# EAGLE design ExternalMotorControllerRev2 (EAGLE 6.4)

## Sheet 1 of 7
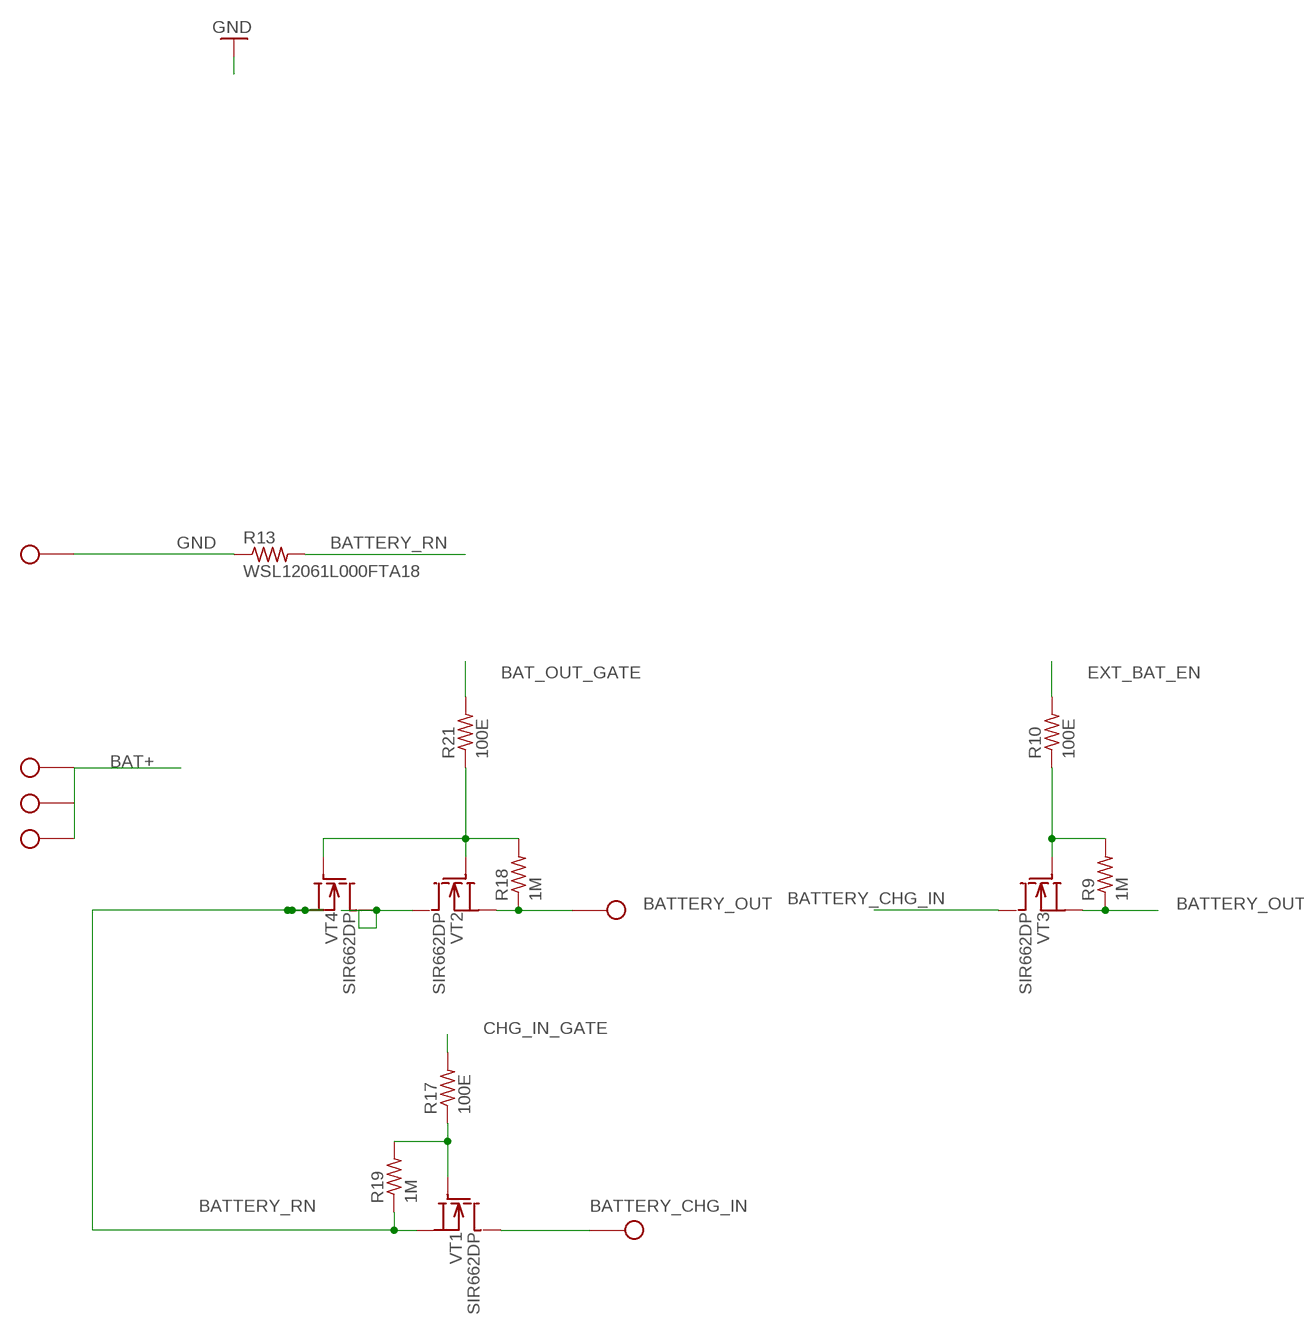
[diagram p0: schematic, sheet 1]

### Parts
R9  1M  R-US_R0402  [R0402]
R10  100E  R-US_R0402  [R0402]
R13  WSL12061L000FTA18  R-US_R2512  [R2512]
R17  100E  R-US_R0402  [R0402]
R18  1M  R-US_R0402  [R0402]
R19  1M  R-US_R0402  [R0402]
R21  100E  R-US_R0402  [R0402]
VT1  SIR662DP  [POWERPAK_SO8]
VT2  SIR662DP  [POWERPAK_SO8]
VT3  SIR662DP  [POWERPAK_SO8]
VT4  SIR662DP  [POWERPAK_SO8]
X1  SOLDER_HOLE18AWG  [SOLDER_HOLE_18]
X2  SOLDER_HOLE18AWG  [SOLDER_HOLE_18]
X3  SOLDER_HOLE18AWG  [SOLDER_HOLE_18]
X4  SOLDER_HOLE18AWG  [SOLDER_HOLE_18]
X5  SOLDER_HOLE18AWG  [SOLDER_HOLE_18]
X13  SOLDER_HOLE18AWG  [SOLDER_HOLE_18]

### Nets
BAT+: X1.1 X4.1 X5.1 ; also sheet 3,4
BAT_OUT_GATE: R21.2 ; also sheet 7
BATTERY_CHG_IN: VT1.D VT3.D X2.1
BATTERY_OUT: R9.1 R18.1 VT2.S1(S) VT2.S2(S) VT2.S3(S) VT3.S1(S) VT3.S2(S) VT3.S3(S) X3.1 ; also sheet 7
BATTERY_RN: R13.2 R19.1 VT1.S1(S) VT1.S2(S) VT1.S3(S) VT4.S1(S) VT4.S2(S) VT4.S3(S) ; also sheet 7
CHG_IN_GATE: R17.2 ; also sheet 7
EXT_BAT_EN: R10.2 ; also sheet 7
GND: R13.1 X13.1 ; also sheet 3,4,7
N$1: R9.2 R10.1 VT3.G
N$5: VT2.D VT4.D
N$24: R18.2 R21.1 VT2.G VT4.G
N$25: R17.1 R19.2 VT1.G

## Sheet 2 of 7

## Sheet 3 of 7
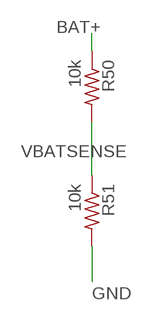
[diagram p1: schematic, sheet 3]

### Parts
R50  10k  R-US_R0402  [R0402]
R51  10k  R-US_R0402  [R0402]

### Nets
BAT+: R50.1 ; also sheet 1,4
GND: R51.2 ; also sheet 1,4,7
VBATSENSE: R50.2 R51.1 ; also sheet 7

## Sheet 4 of 7
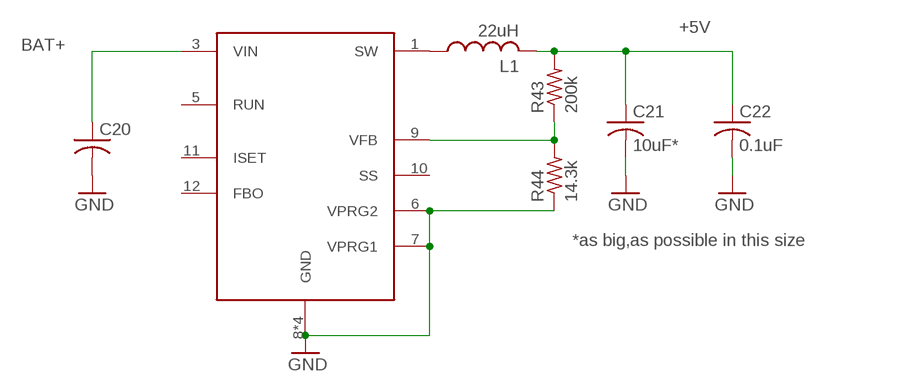
[diagram p2: schematic, sheet 4]

### Parts
C20  RCL_C-USC0805  [RCL_C0805$1]
C21  10uF*  RCL_C-USC4532  [RCL_C4532$1]
C22  0.1uF  C-USC0402  [C0402]
DA2  LTC3630  [MSE16(12)]
L1  22uH  M-PAD-2.1_L_USD  [M-PAD-2.1_1210]
R43  200k  RCL_R-US_R0402  [RCL_R0402]
R44  14.3k  RCL_R-US_R0402  [RCL_R0402]

### Nets
+5V: C21.1 C22.1 L1.2 R43.2 ; also sheet 7
BAT+: C20.1 DA2.3(VIN) ; also sheet 1,3
GND: C20.2 C21.2 C22.2 DA2.6(VPRG2) DA2.7(VPRG1) DA2.8(GND) DA2.14(GND) DA2.16(GND) DA2.17(GND) R44.1 ; also sheet 1,3,7
N$51: DA2.1(SW) L1.1
N$52: DA2.9(VFB) R43.1 R44.2
Unconnected: DA2.5(RUN) DA2.10(SS) DA2.11(ISET) DA2.12(FBO)

### Notes on the sheet
- *as big,as possible in this size

## Sheet 5 of 7

## Sheet 6 of 7

## Sheet 7 of 7
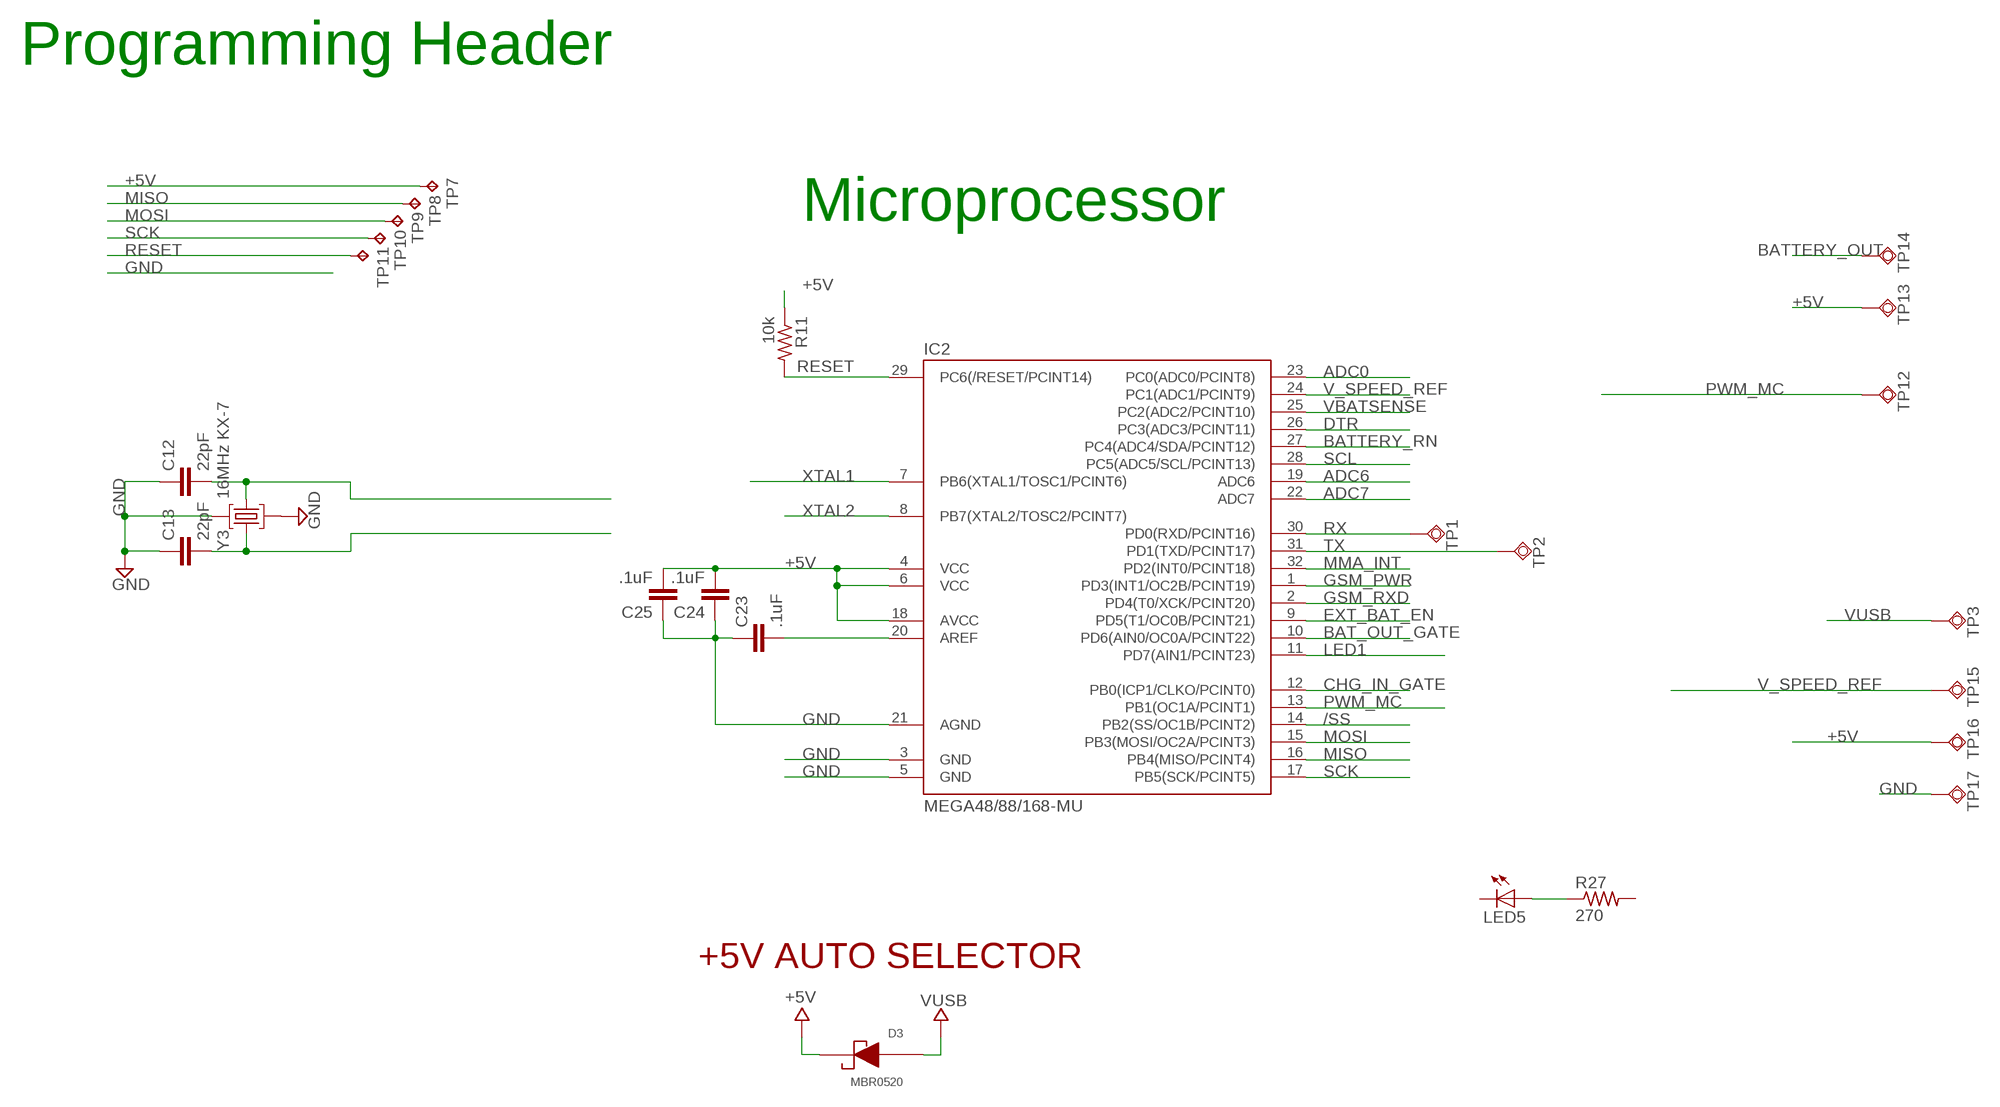
[diagram p3: schematic, sheet 7]

### Parts
C12  22pF  C-EUC0402  [C0402]
C13  22pF  C-EUC0402  [C0402]
C23  .1uF  C-EUC0402  [C0402]
C24  .1uF  C-EUC0402  [C0402]
C25  .1uF  C-EUC0402  [C0402]
D3  MBR0520  [SOD-123]
IC2  MEGA48/88/168-MU  [MLF32]
LED5  LEDCHIP-LED0603  [CHIP-LED0603]
R11  10k  R-US_R0402  [R0402]
R27  270  R-US_R0402  [R0402]
TP1  TPSQTP15R  [TP15R]
TP2  TPSQTP15R  [TP15R]
TP3  TPSQTP15R  [TP15R]
TP7  TPTP08R  [TP08R]
TP8  TPTP08R  [TP08R]
TP9  TPTP08R  [TP08R]
TP10  TPTP08R  [TP08R]
TP11  TPTP10R  [TP10R]
TP12  TPSQTP15SQ  [TP15SQ]
TP13  TPSQTP15SQ  [TP15SQ]
TP14  TPSQTP15SQ  [TP15SQ]
TP15  TPSQTP15R  [TP15R]
TP16  TPSQTP15SQ  [TP15SQ]
TP17  TPSQTP15SQ  [TP15SQ]
Y3  16MHz KX-7  CRYSTAL-3.2-2.5  [CRYSTAL-3.2-2.5]

### Nets
+5V: C24.2 C25.2 D3.1(CA) IC2.4(VCC) IC2.6(VCC) IC2.18(AVCC) R11.1 TP7.TP TP13.TP TP16.TP ; also sheet 4
/SS: IC2.14(PB2(SS/OC1B/PCINT2))
ADC0: IC2.23(PC0(ADC0/PCINT8))
ADC6: IC2.19(ADC6)
ADC7: IC2.22(ADC7)
BAT_OUT_GATE: IC2.10(PD6(AIN0/OC0A/PCINT22)) ; also sheet 1
BATTERY_OUT: TP14.TP ; also sheet 1
BATTERY_RN: IC2.27(PC4(ADC4/SDA/PCINT12)) ; also sheet 1
CHG_IN_GATE: IC2.12(PB0(ICP1/CLKO/PCINT0)) ; also sheet 1
DTR: IC2.26(PC3(ADC3/PCINT11))
EXT_BAT_EN: IC2.9(PD5(T1/OC0B/PCINT21)) ; also sheet 1
GND: C12.1 C13.1 C23.1 C24.1 C25.1 IC2.3(GND) IC2.5(GND) IC2.21(AGND) TP17.TP Y3.2(GND) Y3.4(GND) ; also sheet 1,3,4
GSM_PWR: IC2.1(PD3(INT1/OC2B/PCINT19))
GSM_RXD: IC2.2(PD4(T0/XCK/PCINT20))
LED1: IC2.11(PD7(AIN1/PCINT23))
MISO: IC2.16(PB4(MISO/PCINT4)) TP8.TP
MMA_INT: IC2.32(PD2(INT0/PCINT18))
MOSI: IC2.15(PB3(MOSI/OC2A/PCINT3)) TP9.TP
N$36: C23.2 IC2.20(AREF)
N$50: LED5.A R27.1
PWM_MC: IC2.13(PB1(OC1A/PCINT1)) TP12.TP
RESET: IC2.29(PC6(/RESET/PCINT14)) R11.2 TP11.TP
RX: IC2.30(PD0(RXD/PCINT16)) TP1.TP
SCK: IC2.17(PB5(SCK/PCINT5)) TP10.TP
SCL: IC2.28(PC5(ADC5/SCL/PCINT13))
TX: IC2.31(PD1(TXD/PCINT17)) TP2.TP
V_SPEED_REF: IC2.24(PC1(ADC1/PCINT9)) TP15.TP
VBATSENSE: IC2.25(PC2(ADC2/PCINT10)) ; also sheet 3
VUSB: D3.2(AN) TP3.TP
XTAL1: C13.2 IC2.7(PB6(XTAL1/TOSC1/PCINT6)) Y3.3(C2)
XTAL2: C12.2 IC2.8(PB7(XTAL2/TOSC2/PCINT7)) Y3.1(C1)
Unconnected: LED5.C R27.2

### Notes on the sheet
- Programming Header
- Microprocessor
- +5V AUTO SELECTOR

## Library data of the parts
C12 C13 = SmartPrj:C-EU: CAPACITOR, European symbol
C20 C21 = MotorController_r0:RCL_C-US: CAPACITOR, American symbol
C22 = rcl:C-US: CAPACITOR, American symbol
C23-C25 = rcl:C-EU: CAPACITOR, European symbol
D3 = MySMD:MBR0520
DA2 = my:LTC3630
IC2 = avr-5:MEGA48/88/168
L1 = MotorController_r0:M-PAD-2.1_L_US: Inductors in various packages from: - Sumida - Panasonic - Coilcraft
LED5 = led:LED: LED OSRAM: - CHIPLED LG R971, LG N971, LY N971, LG Q971, LY Q971, LO R971, LY R971 LH N974, LH R974 LS Q976, LO Q976, LY Q976 LO Q996 - Hyper CHIPLED LW Q18S LB Q993, LB Q99A, LB R99A - SideLED LS A670, LO A670, LY A670, LG A670, LP A670 LB A673, LV A673, LT A673, LW A673 LH A674 LY A675 LS A676, LA A676, LO A676, LY A676, LW A676 LS A679, LY A679, LG A679 - Hyper Micro SIDELED® LS Y876, LA Y876, LO Y876, LY Y876 LT Y87S - SmartLED LW L88C, LW L88S LB L89C, LB L89S, LG L890 LS L89K, LO L89K, LY L89K LS L896, LA L896, LO L896, LY L896 - TOPLED LS T670, LO T670, LY T670, LG T670, LP T670 LSG T670, LSP T670, LSY T670, LOP T670, LYG T670 LG T671, LOG T671, LSG T671 LB T673, LV T673, LT T673, LW T673 LH T674 LS T676, LA T676, LO T676, LY T676, LB T676, LH T676, LSB T676, LW T676 LB T67C, LV T67C, LT T67C, LS T67K, LO T67K, LY T67K, LW E67C LS E67B, LA E67B, LO E67B, LY E67B, LB E67C, LV E67C, LT E67C LW T67C LS T679, LY T679, LG T679 LS T770, LO T770, LY T770, LG T770, LP T770 LB T773, LV T773, LT T773, LW T773 LH T774 LS E675, LA E675, LY E675, LS T675 LS T776, LA T776, LO T776, LY T776, LB T776 LHGB T686 LT T68C, LB T68C - Hyper Mini TOPLED® LB M676 - Mini TOPLED Santana® LG M470 LS M47K, LO M47K, LY M47K Source: http://www.osram.convergy.de LUXEON: - LUMILED® LXK2-PW12-R00, LXK2-PW12-S00, LXK2-PW14-U00, LXK2-PW14-V00 LXK2-PM12-R00, LXK2-PM12-S00, LXK2-PM14-U00 LXK2-PE12-Q00, LXK2-PE12-R00, LXK2-PE12-S00, LXK2-PE14-T00, LXK2-PE14-U00 LXK2-PB12-K00, LXK2-PB12-L00, LXK2-PB12-M00, LXK2-PB14-N00, LXK2-PB14-P00, LXK2-PB14-Q00 LXK2-PR12-L00, LXK2-PR12-M00, LXK2-PR14-Q00, LXK2-PR14-R00 LXK2-PD12-Q00, LXK2-PD12-R00, LXK2-PD12-S00 LXK2-PH12-R00, LXK2-PH12-S00 LXK2-PL12-P00, LXK2-PL12-Q00, LXK2-PL12-R00 Source: www.luxeon.com KINGBRIGHT: KA-3528ASYC Source: www.kingbright.com
R9 R10 R13 R17-R19 R21 = ForBattery:R-US_: RESISTOR, American symbol
R11 R27 R50 R51 = rcl:R-US_: RESISTOR, American symbol
R43 R44 = MotorController_r0:RCL_R-US_: RESISTOR, American symbol
TP1-TP3 TP12-TP17 = testpad:TPSQ: Test pad
TP7-TP11 = testpad:TP: Test pad
VT1-VT4 = ForBattery:SIR662DP
X1-X5 X13 = ForBattery:SOLDER_HOLE
Y3 = SmartPrj:CRYSTAL-3.2-2.5

## Board
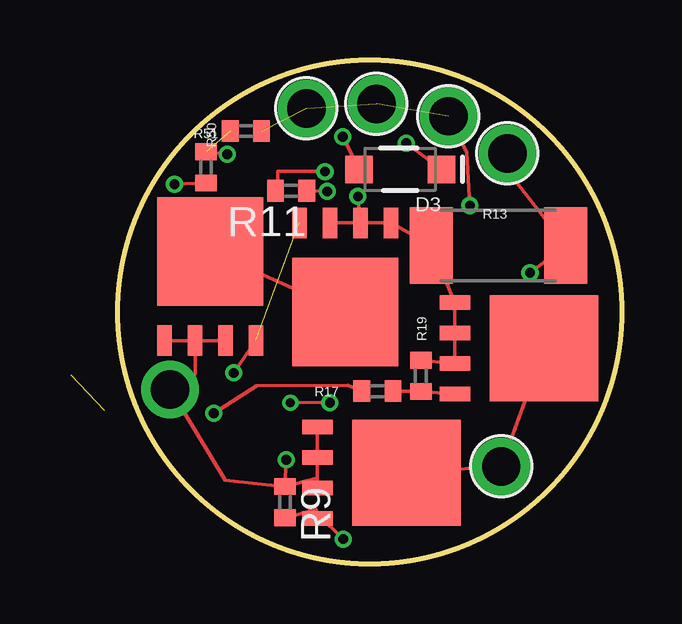
[diagram p4: board, top side]
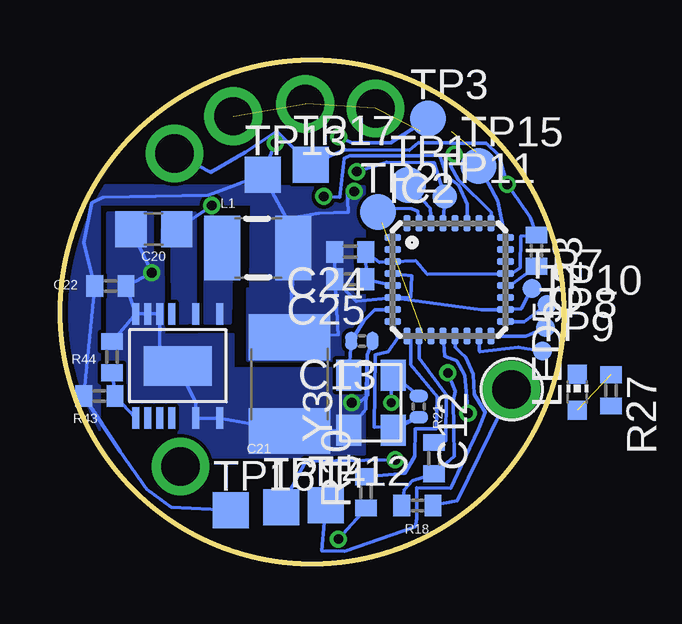
[diagram p5: board, bottom side, seen from below]

Size 21 x 21 mm. Coordinates in mm from the lower left corner, seen from the top.
Outline: circle at 10.5,10.5 radius 10.5
Copper layers (1*16): Top 0.035mm / dielectric 1.5mm / Bottom 0.035mm
Design rules "default *": minimum track width 6mil, minimum drill 16mil, track to track 6mil, track to pad 6mil, pad to pad 6mil, via to via 6mil, smd to smd 6mil, copper to edge 10mil, drill to drill 8mil, minimum pad ring 6mil, minimum via ring 6mil, stop-mask expansion 4mil, vias tented up to drill 0mil, thermal gap 10mil

### Footprints (pad centres in the part's own frame; a part is rotated, then mirrored left to right if it is on the bottom)
C0402 = smd 0.508 x 0.762: 1 -0.445,0; 2 0.445,0
RCL_C0805$1 = smd 1.3 x 1.5: 1 -0.95,0; 2 0.95,0
RCL_C4532$1 = smd 1.9 x 3.4: 1 -1.95,0; 2 1.95,0
C0402' = smd 0.7 x 0.9: 1 -0.65,0; 2 0.65,0
SOD-123 = smd 1.143 x 1.143: 1 0,0; 2 3.429,0
MSE16(12) = smd 0.305 x 0.889: 1 -1.75,-2.171; 3 -0.75,-2.171; 5 0.25,-2.171; 6 0.75,-2.171; 7 1.25,-2.171; 8 1.75,-2.171; 9 1.75,2.171; 10 1.25,2.171; 11 0.75,2.171; 12 0.25,2.171; 14 -0.75,2.171; 16 -1.75,2.171 | smd 2.845 x 1.651: 17 0,0
MLF32 = smd 0.7 x 0.3: 1 -2.35,1.75; 2 -2.35,1.25; 3 -2.35,0.75; 4 -2.35,0.25; 5 -2.35,-0.25; 6 -2.35,-0.75; 7 -2.35,-1.25; 8 -2.35,-1.75; 17 2.35,-1.75; 18 2.35,-1.25; 19 2.35,-0.75; 20 2.35,-0.25; 21 2.35,0.25; 22 2.35,0.75; 23 2.35,1.25; 24 2.35,1.75 | smd 0.3 x 0.7: 9 -1.75,-2.35; 10 -1.25,-2.35; 11 -0.75,-2.35; 12 -0.25,-2.35; 13 0.25,-2.35; 14 0.75,-2.35; 15 1.25,-2.35; 16 1.75,-2.35; 25 1.75,2.35; 26 1.25,2.35; 27 0.75,2.35; 28 0.25,2.35; 29 -0.25,2.35; 30 -0.75,2.35; 31 -1.25,2.35; 32 -1.75,2.35
M-PAD-2.1_1210 = smd 1.5 x 2.7: 1 -1.5,0; 2 1.45,0
CHIP-LED0603 = smd 0.8 x 0.8: A 0,-0.75; C 0,0.75
R0402 = smd 0.7 x 0.9: 1 -0.65,0; 2 0.65,0
R2512 = smd 1.8 x 3.2: 1 -2.8,0; 2 2.8,0
RCL_R0402 = smd 0.7 x 0.9: 1 -0.65,0; 2 0.65,0
TP15R = smd 1.5 x 1.5: TP 0,0
TP08R = smd 0.8 x 0.8: TP 0,0
TP10R = smd 1 x 1: TP 0,0
TP15SQ = smd 1.5 x 1.5: TP 0,0
POWERPAK_SO8 = smd 4.52 x 4.42: D 3.715,0 | smd 1.27 x 0.61: G 0,-1.905; S1 0,1.905; S2 0,0.635; S3 0,-0.635
SOLDER_HOLE_18 = drill 1.6: 1 0,0
CRYSTAL-3.2-2.5 = smd 1.3 x 1.05: 1 -1.15,-0.925; 2 1.15,-0.925; 3 1.15,0.925; 4 -1.15,0.925

### Placement (x,y rotation side)
C12  6.05,6.56 270 bottom
C13  8.42,9.29 180 bottom
C20  17.09,13.96 180 bottom
C21  11.44,7.5 270 bottom
C22  0.1uF  [C0402']  18.9,11.58 0 bottom
C23  .1uF  [C0402']  1.14,13.05 270 bottom
C24  .1uF  [C0402']  8.91,13.01 180 bottom
C25  .1uF  [C0402']  8.9,11.86 180 bottom
D3  13.48,16.44 180 top
DA2  16.09,8.25 180 bottom
IC2  4.79,11.85 0 bottom
L1  12.74,13.17 0 bottom
LED5  -0.55,7.16 0 bottom
R9  6.97,2.58 270 top
R10  8.25,2.98 90 bottom
R11  7.22,15.55 180 top
R13  15.87,13.27 180 top
R17  10.82,7.2 180 top
R18  6.11,2.44 180 bottom
R19  12.63,7.84 270 top
R21  5.41,4.41 90 bottom
R27  -1.95,7.23 270 bottom
R43  19.36,7 180 bottom
R44  18.83,8.62 270 bottom
R50  5.34,18.04 180 top
R51  3.68,16.53 270 top
TP1  6.5,15.79 0 bottom
TP2  7.75,14.66 0 bottom
TP3  5.67,18.56 0 bottom
TP7  1.33,11.48 0 bottom
TP8  0.76,9.85 0 bottom
TP9  0.89,8.87 0 bottom
TP10  0.71,10.8 0 bottom
TP11  4.97,15.31 0 bottom
TP12  9.93,2.44 0 bottom
TP13  12.56,16.22 0 bottom
TP14  11.79,2.37 0 bottom
TP15  3.56,16.59 0 bottom
TP16  13.88,2.24 0 bottom
TP17  10.55,16.63 0 bottom
VT1  14.05,8.99 0 top
VT2  3.86,9.31 90 top
VT3  8.32,3.8 0 top
VT4  9.48,14.22 270 top
X1  7.86,18.98 0 top
X2  15.98,4.06 0 top
X3  2.18,7.27 0 bottom
X4  13.78,18.65 0 top
X5  10.78,19.17 0 top
X13  16.24,17.11 0 top
Y3  8.05,6.72 90 bottom

### Tracks (layer width: path | path; a pad name or v marks a point on that pad's centre or on a via)
+5V  (via drill 0.41)
  Top 0.152: R11.1 v8.74,15.52 | D3.1 v12.02,17.54
  Bottom 0.152: TP7.TP 1.79,10.63 IC2.18 3.46,10.6 IC2.6 | v8.74,15.52 9.03,15.61 8.99,14.66 10.21,14.61 11.56,14.4 | C25.2 C24.2 | C25.2 9.4,9.54 C21.1 | C21.1 L1.2 | C25.2 8.65,10.95 IC2.6 | IC2.4 6.34,12.01 6.39,11.11 IC2.6 | TP16.TP 16.37,2.36 17.38,3.12 18.5,4.68 R43.2 C22.1 20.01,13.39 19.68,15.06 19.19,15.29 14.82,15.37 TP13.TP | C21.1 11.2,13.75 11.56,14.4 | 11.56,14.4 TP13.TP | v12.02,17.54 TP13.TP
  pour Bottom (no thermals): 8.33,8.54 8.33,15.72 21.44,15.78 21.44,4.39 19.37,4.39 19.37,15.01 13,15.01 13.05,11.46 13.17,11.47 13.17,8.49 8.78,8.47
  pour Bottom: 9.76,9.82 13,9.82 13,11.43 9.7,11.43 9.7,10.19
BAT+  (via drill 0.41)  (3 unrouted)
  Top 0.152: v14.68,14.94 14.55,17.16 X4.1
  Bottom 0.152: C20.1 v14.68,14.94
  pour Bottom (no thermals): 15.36,10.07 15.36,14.61 16.7,14.61 16.76,13.36 16.33,13.34 16.31,10.05 15.67,10.05
BAT_OUT_GATE
  Bottom 0.152: IC2.10 6.04,8.57 4.9,7.04 4.92,5.13 R21.2
BATTERY_CHG_IN
  Top 0.152: VT3.D X2.1 VT1.D
BATTERY_OUT  (via drill 0.41)
  Top 0.152: R9.1 8.27,3.56 VT3.S3 VT3.S2 VT3.S1 | VT2.S1 VT2.S2 | VT2.S2 VT2.S3 | VT2.S2 3.22,7.94 X3.1 4.49,3.5 R9.1 | v7.02,4.34 R9.1
  Bottom 0.152: R18.1 4.45,2.64 X3.1 | TP14.TP 10.77,4.28 v7.02,4.34
BATTERY_RN  (via drill 0.41)
  Top 0.152: R19.1 VT1.S3 VT1.S2 VT1.S1 R13.2 VT4.S1 VT4.S2 | v10.01,15.32 VT4.S2 | VT4.S3 VT4.S2
  Bottom 0.152: v10.01,15.32 9.34,15.27 9.16,16.91 8.93,17 5.97,17.02 5.17,17.03 4.88,16.16 4.39,15.77 4.04,14.98 IC2.27
CHG_IN_GATE  (via drill 0.41)
  Top 0.152: v4,6.28 5.8,7.42 9.58,7.45 R17.2
  Bottom 0.152: v4,6.28 4.14,7.86 4.47,8.48 4.97,8.66 IC2.12
EXT_BAT_EN
  Bottom 0.152: R10.2 6.64,3.79 6.22,4.48 6.2,5.63 5.32,5.64 5.27,6.96 6.39,8.3 6.39,9.49 IC2.9
GND  (via drill 0.38, 0.41)
  Top 0.152: X13.1 16.04,16.64 R13.1 v17.18,12.14 | v8.84,6.72 7.28,6.73 v7.2,6.72 | R51.2 v2.37,15.82
  Bottom 0.152: C12.1 Y3.2 7.23,7.76 v7.2,6.72 | IC2.5 C25.1 C24.1 7.7,12.57 IC2.3 6.17,12.64 5.69,12.07 IC2.21 2.17,12.12 1.83,12.35 1.8,13.65 C23.1 1.41,14.44 v2.37,15.82 2.72,17.03 3.24,17.54 4.77,17.54 4.81,17.55 6.08,17.55 6.44,17.25 9.09,17.25 9.3,17.2 TP17.TP 11.97,18.04 13.28,17.15 14.72,16.32 X13.1 | C20.2 v17.18,12.14 C22.2 DA2.8 | DA2.8 DA2.7 DA2.6 16.84,9.05 DA2.17 15.34,6.72 DA2.14 DA2.16 C21.2 Y3.4 8.25,6.45 8.19,8.72 | DA2.8 R44.1 | C13.1 8.19,8.72 | 8.19,8.72 8.18,7.03 8.58,6.69 8.73,6.69 v8.84,6.72
  pour Bottom (no thermals): 8.28,8.14 13.8,8.14 13.8,9.58 16.68,9.54 16.72,12.86 17.16,12.84 17.15,14.62 19.01,14.62 19.02,4.46 8.33,4.46 8.33,7.63
MISO
  Bottom 0.152: IC2.16 1.6,9.5 TP8.TP
MOSI
  Bottom 0.152: IC2.15 3.54,8.89 3.5,8.85 1.91,9.02 TP9.TP
N$1  (via drill 0.41)
  Top 0.152: R9.2 8.27,2.26 VT3.G 8.01,2.25 8.38,2.02 v9.4,1.04
  Bottom 0.152: v9.4,1.04 R10.1
N$5
  Top 0.152: VT2.D VT4.D
N$24  (via drill 0.41)  (1 unrouted)
  Top 0.152: v4.84,7.96 VT2.G
  Bottom 0.152: v4.84,7.96 4.53,7.21 4.6,6.8 4.58,4.49 R21.1 6.31,3.48 6.65,3.09 R18.2
N$25
  Top 0.152: R17.1 R19.2 VT1.G
N$36
  Bottom 0.152: IC2.20 2.18,11.65 C23.2
N$50  (1 unrouted)
N$51
  pour Bottom (no thermals): 13.83,14.41 13.9,10.05 14.96,10.04 14.95,14.45 14.04,14.45
N$52
  Bottom 0.152: R44.2 R43.1 DA2.9
PWM_MC
  Bottom 0.152: IC2.13 4.54,9.04 4.33,8.83 4.32,8.83 4.1,8.61 3.79,7.91 3.74,7.07 3.27,6.31 3.56,5.63 4.27,4.09 4.71,3.16 6.13,3.17 6.13,1.9 6.21,1.55 9.14,0.54 10.09,0.55 TP12.TP
RESET  (via drill 0.41)
  Top 0.152: v8.64,16.35 8.62,16.37 6.67,16.37 6.67,15.55 R11.2
  Bottom 0.152: IC2.29 TP11.TP 5.4,16.73 7.39,16.74 v8.64,16.35
RX
  Bottom 0.152: IC2.30 5.58,14.82 TP1.TP
SCK
  Bottom 0.152: IC2.17 1.66,10.1 TP10.TP
TX
  Bottom 0.152: IC2.31 6.09,14.69 6.34,14.79 7.78,14.82 TP2.TP
V_SPEED_REF
  Bottom 0.152: IC2.24 2.76,15.13 TP15.TP
VBATSENSE  (via drill 0.41)  (1 unrouted)
  Top 0.152: v4.57,17.08 R51.1
  Bottom 0.152: IC2.25 3.04,14.65 4.4,16.01 4.72,16.57 v4.57,17.08
VUSB  (via drill 0.41)
  Top 0.152: v9.38,17.8 D3.2
  Bottom 0.152: TP3.TP 7.22,17.55 8.85,17.55 v9.38,17.8
XTAL1
  Bottom 0.152: Y3.3 C13.2 8.35,10.13 7.89,10.59 7.15,10.59 IC2.7
XTAL2
  Bottom 0.152: Y3.1 C12.2 7.06,5.72 7.9,5.7 7.87,8.72 7.31,8.85 6.94,9.43 IC2.8

### Text on the board
tNames: Kyle Hagin 2014